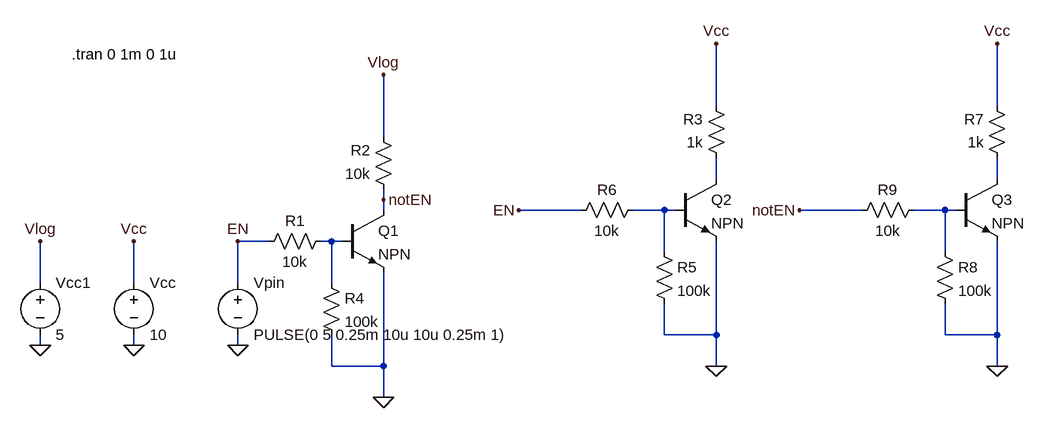
[diagram p0: schematic circuit_switch.asc]
circuit_switch.asc, the LTspice schematic file:
Version 4
SHEET 1 1276 980
WIRE 224 320 224 224
WIRE 656 320 656 224
WIRE -288 368 -288 272
WIRE 224 432 224 400
WIRE 656 432 656 400
WIRE -288 464 -288 448
WIRE -288 480 -288 464
WIRE 16 480 -80 480
WIRE 144 480 96 480
WIRE 160 480 144 480
WIRE 448 480 352 480
WIRE 576 480 528 480
WIRE 592 480 576 480
WIRE -464 528 -512 528
WIRE -368 528 -384 528
WIRE -352 528 -368 528
WIRE 144 544 144 480
WIRE 576 544 576 480
WIRE -816 592 -816 528
WIRE -672 592 -672 528
WIRE -512 592 -512 528
WIRE -368 592 -368 528
WIRE 144 672 144 624
WIRE 224 672 224 528
WIRE 224 672 144 672
WIRE 576 672 576 624
WIRE 656 672 656 528
WIRE 656 672 576 672
WIRE -816 688 -816 672
WIRE -672 688 -672 672
WIRE -512 688 -512 672
WIRE -368 720 -368 672
WIRE -288 720 -288 576
WIRE -288 720 -368 720
WIRE 224 720 224 672
WIRE 656 720 656 672
WIRE -288 768 -288 720
FLAG -512 688 0
FLAG -672 688 0
FLAG -512 528 EN
FLAG -672 528 Vcc
FLAG -288 272 Vlog
FLAG -288 768 0
FLAG -288 464 notEN
FLAG 224 224 Vcc
FLAG 224 720 0
FLAG 656 224 Vcc
FLAG 656 720 0
FLAG -816 688 0
FLAG -816 528 Vlog
FLAG -80 480 EN
FLAG 352 480 notEN
SYMBOL npn -352 480 R0
SYMATTR InstName Q1
SYMBOL res -368 512 R90
WINDOW 0 0 56 VBottom 2
WINDOW 3 32 56 VTop 2
SYMATTR InstName R1
SYMATTR Value 10k
SYMBOL res -272 464 R180
WINDOW 0 36 76 Left 2
WINDOW 3 36 40 Left 2
SYMATTR InstName R2
SYMATTR Value 10k
SYMBOL voltage -512 576 R0
SYMATTR InstName Vpin
SYMATTR Value PULSE(0 5 0.25m 10u 10u 0.25m 1)
SYMBOL voltage -672 576 R0
SYMATTR InstName Vcc
SYMATTR Value 10
SYMBOL res -384 576 R0
SYMATTR InstName R4
SYMATTR Value 100k
SYMBOL npn 160 432 R0
SYMATTR InstName Q2
SYMBOL res 240 416 R180
WINDOW 0 36 76 Left 2
WINDOW 3 36 40 Left 2
SYMATTR InstName R3
SYMATTR Value 1k
SYMBOL res 128 528 R0
SYMATTR InstName R5
SYMATTR Value 100k
SYMBOL res 112 464 R90
WINDOW 0 0 56 VBottom 2
WINDOW 3 32 56 VTop 2
SYMATTR InstName R6
SYMATTR Value 10k
SYMBOL npn 592 432 R0
SYMATTR InstName Q3
SYMBOL res 672 416 R180
WINDOW 0 36 76 Left 2
WINDOW 3 36 40 Left 2
SYMATTR InstName R7
SYMATTR Value 1k
SYMBOL res 560 528 R0
SYMATTR InstName R8
SYMATTR Value 100k
SYMBOL res 544 464 R90
WINDOW 0 0 56 VBottom 2
WINDOW 3 32 56 VTop 2
SYMATTR InstName R9
SYMATTR Value 10k
SYMBOL voltage -816 576 R0
SYMATTR InstName Vcc1
SYMATTR Value 5
TEXT -768 240 Left 2 !.tran 0 1m 0 1u

The netlist it stands for:
* circuit_switch.asc
Q1 notEN N005 0 0 NPN
R1 N005 EN 10k
R2 notEN Vlog 10k
Vpin EN 0 PULSE(0 5 0.25m 10u 10u 0.25m 1)
Vcc Vcc 0 10
R4 N005 0 100k
Q2 N001 N003 0 0 NPN
R3 N001 Vcc 1k
R5 N003 0 100k
R6 N003 EN 10k
Q3 N002 N004 0 0 NPN
R7 N002 Vcc 1k
R8 N004 0 100k
R9 N004 notEN 10k
Vcc1 Vlog 0 5
.model NPN NPN
.model PNP PNP
.lib standard.bjt
.tran 0 1m 0 1u
.backanno
.end